# Altium schematic sheet SW SMALL.SchDoc
size C
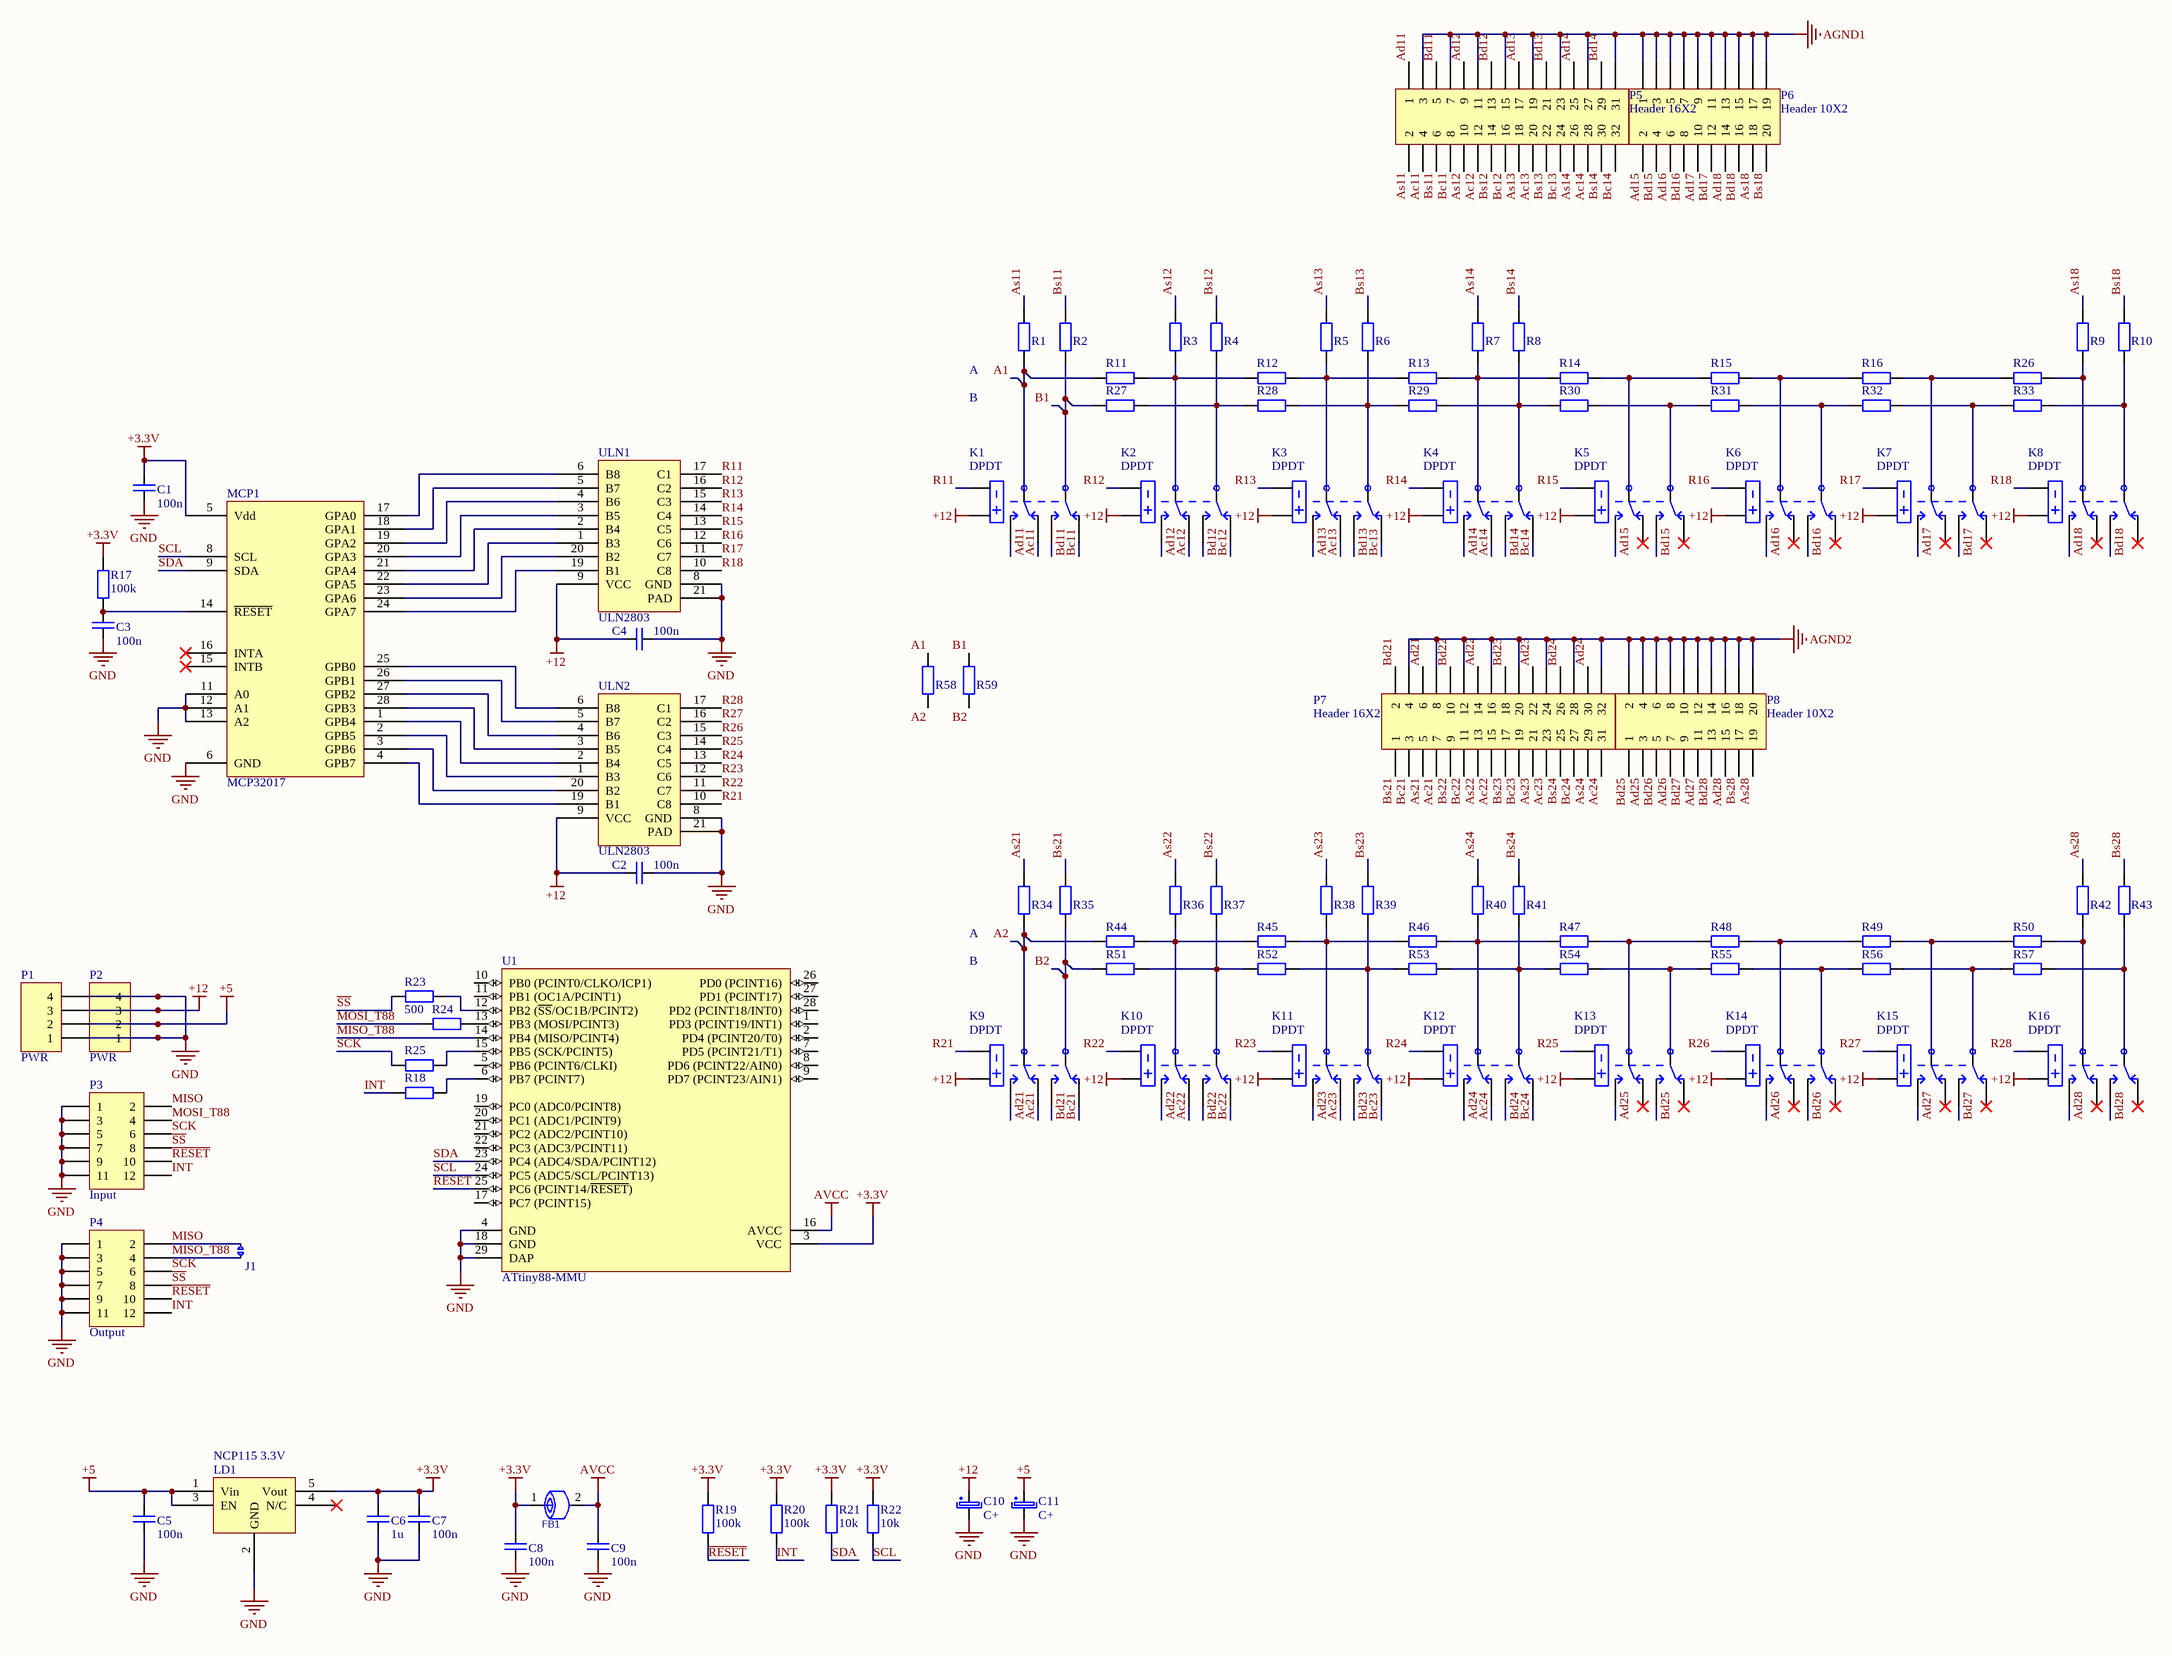
[diagram p0: SW SMALL.SchDoc]

## Parts
C1  100n  [R1005_0402i_L]
C2  100n  [R1005_0402i_L]
C3  100n  [R1005_0402i_L]
C4  100n  [R1005_0402i_L]
C5  100n  [R1005_0402i_L]
C6  1u  [C1608_0603I_L]
C7  100n  [R1005_0402i_L]
C8  100n  [R1005_0402i_L]
C9  100n  [R1005_0402i_L]
C10  C+  [C AlElko 5x11 R2]
C11  C+  [C AlElko 5x11 R2]
FB1  FERITTE BEAD  [R1608_0603I_L]  (value not drawn)
J1  Terminator  [solderJumper]  (value not drawn)
K1  DPDT  [AXICOM IM-G Relay]
K2  DPDT  [AXICOM IM-G Relay]
K3  DPDT  [AXICOM IM-G Relay]
K4  DPDT  [AXICOM IM-G Relay]
K5  DPDT  [AXICOM IM-G Relay]
K6  DPDT  [AXICOM IM-G Relay]
K7  DPDT  [AXICOM IM-G Relay]
K8  DPDT  [AXICOM IM-G Relay]
K9  DPDT  [AXICOM IM-G Relay]
K10  DPDT  [AXICOM IM-G Relay]
K11  DPDT  [AXICOM IM-G Relay]
K12  DPDT  [AXICOM IM-G Relay]
K13  DPDT  [AXICOM IM-G Relay]
K14  DPDT  [AXICOM IM-G Relay]
K15  DPDT  [AXICOM IM-G Relay]
K16  DPDT  [AXICOM IM-G Relay]
LD1  NCP115 3.3V  [TSOP95P280X110-6L]
MCP1  MCP32017  [MCP23017 QFN]
P1  PWR  [HDR1X4]
P2  PWR  [HDR1X4]
P3  Input  [1.27mm SMD conn]
P4  Output  [1.27mm SMD conn]
P5  Header 16X2  [HDR2X16]
P6  Header 10X2  [HDR2X10]
P7  Header 16X2  [HDR2X16]
P8  Header 10X2  [HDR2X10]
R1  R  [R1608_0603I_L]  (value not drawn)
R2  R  [R1608_0603I_L]  (value not drawn)
R3  R  [R1608_0603I_L]  (value not drawn)
R4  R  [R1608_0603I_L]  (value not drawn)
R5  R  [R1608_0603I_L]  (value not drawn)
R6  R  [R1608_0603I_L]  (value not drawn)
R7  R  [R1608_0603I_L]  (value not drawn)
R8  R  [R1608_0603I_L]  (value not drawn)
R9  R  [R1608_0603I_L]  (value not drawn)
R10  R  [R1608_0603I_L]  (value not drawn)
R11  R  [R1608_0603I_L]  (value not drawn)
R12  R  [R1608_0603I_L]  (value not drawn)
R13  R  [R1608_0603I_L]  (value not drawn)
R14  R  [R1608_0603I_L]  (value not drawn)
R15  R  [R1608_0603I_L]  (value not drawn)
R16  R  [R1608_0603I_L]  (value not drawn)
R17  100k  [R1005_0402i_L]
R18  500  [R1005_0402i_L]  (value not drawn)
R19  100k  [R1005_0402i_L]
R20  100k  [R1005_0402i_L]
R21  10k  [R1005_0402i_L]
R22  10k  [R1005_0402i_L]
R23  500  [R1005_0402i_L]
R24  500  [R1005_0402i_L]  (value not drawn)
R25  500  [R1005_0402i_L]  (value not drawn)
R26  R  [R1608_0603I_L]  (value not drawn)
R27  R  [R1608_0603I_L]  (value not drawn)
R28  R  [R1608_0603I_L]  (value not drawn)
R29  R  [R1608_0603I_L]  (value not drawn)
R30  R  [R1608_0603I_L]  (value not drawn)
R31  R  [R1608_0603I_L]  (value not drawn)
R32  R  [R1608_0603I_L]  (value not drawn)
R33  R  [R1608_0603I_L]  (value not drawn)
R34  R  [R1608_0603I_L]  (value not drawn)
R35  R  [R1608_0603I_L]  (value not drawn)
R36  R  [R1608_0603I_L]  (value not drawn)
R37  R  [R1608_0603I_L]  (value not drawn)
R38  R  [R1608_0603I_L]  (value not drawn)
R39  R  [R1608_0603I_L]  (value not drawn)
R40  R  [R1608_0603I_L]  (value not drawn)
R41  R  [R1608_0603I_L]  (value not drawn)
R42  R  [R1608_0603I_L]  (value not drawn)
R43  R  [R1608_0603I_L]  (value not drawn)
R44  R  [R1608_0603I_L]  (value not drawn)
R45  R  [R1608_0603I_L]  (value not drawn)
R46  R  [R1608_0603I_L]  (value not drawn)
R47  R  [R1608_0603I_L]  (value not drawn)
R48  R  [R1608_0603I_L]  (value not drawn)
R49  R  [R1608_0603I_L]  (value not drawn)
R50  R  [R1608_0603I_L]  (value not drawn)
R51  R  [R1608_0603I_L]  (value not drawn)
R52  R  [R1608_0603I_L]  (value not drawn)
R53  R  [R1608_0603I_L]  (value not drawn)
R54  R  [R1608_0603I_L]  (value not drawn)
R55  R  [R1608_0603I_L]  (value not drawn)
R56  R  [R1608_0603I_L]  (value not drawn)
R57  R  [R1608_0603I_L]  (value not drawn)
R58  R  [R1608_0603I_L]  (value not drawn)
R59  R  [R1608_0603I_L]  (value not drawn)
U1  ATtiny88-MMU  [28M1_N]
ULN1  ULN2803  [QFN127P600-8N]
ULN2  ULN2803  [QFN127P600-8N]

## Nets
+3.3V: C1.2 C6.1 C7.1 C8.1 FB1.1 LD1.5(Vout) MCP1.5(Vdd) R17.1 R19.1 R20.1 R21.1 R22.1 U1.3(VCC)
+5: C5.1 C11.1 LD1.1(Vin) LD1.3(EN) P1.2 P2.2
+12: C2.1 C4.1 C10.1 K1.1 K2.1 K3.1 K4.1 K5.1 K6.1 K7.1 K8.1 K9.1 K10.1 K11.1 K12.1 K13.1 K14.1 K15.1 K16.1 P1.3 P2.3 ULN1.9(VCC) ULN2.9(VCC)
AGND1: P5.3 P5.7 P5.11 P5.15 P5.19 P5.23 P5.27 P5.31 P6.1 P6.3 P6.5 P6.7 P6.9 P6.11 P6.13 P6.15 P6.17 P6.19
AGND2: P7.4 P7.8 P7.12 P7.16 P7.20 P7.24 P7.28 P7.32 P8.2 P8.4 P8.6 P8.8 P8.10 P8.12 P8.14 P8.16 P8.18 P8.20
AVCC: C9.1 FB1.2 U1.16(AVCC)
GND: C1.1 C2.2 C3.1 C4.2 C5.2 C6.2 C7.2 C8.2 C9.2 C10.2 C11.2 LD1.2(GND) MCP1.6(GND) MCP1.11(A0) MCP1.12(A1) MCP1.13(A2) P1.1 P1.4 P2.1 P2.4 P3.1 P3.3 P3.5 P3.7 P3.9 P3.11 P4.1 P4.3 P4.5 P4.7 P4.9 P4.11 U1.4(GND) U1.18(GND) U1.29(DAP) ULN1.8(GND) ULN1.21(PAD) ULN2.8(GND) ULN2.21(PAD)
A1: K1.3 R1.1 R11.1 R58.2
A2: K9.3 R34.1 R44.1 R58.1
Ac11: K1.2 P5.4
Ac12: K2.2 P5.12
Ac13: K3.2 P5.20
Ac14: K4.2 P5.28
Ac21: K9.2 P7.7
Ac22: K10.2 P7.15
Ac23: K11.2 P7.23
Ac24: K12.2 P7.31
Ad11: K1.4 P5.1
Ad12: K2.4 P5.9
Ad13: K3.4 P5.17
Ad14: K4.4 P5.25
Ad15: K5.4 P6.2
Ad16: K6.4 P6.6
Ad17: K7.4 P6.10
Ad18: K8.4 P6.14
Ad21: K9.4 P7.6
Ad22: K10.4 P7.14
Ad23: K11.4 P7.22
Ad24: K12.4 P7.30
Ad25: K13.4 P8.3
Ad26: K14.4 P8.7
Ad27: K15.4 P8.11
Ad28: K16.4 P8.15
As11: P5.2 R1.2
As12: P5.10 R3.2
As13: P5.18 R5.2
As14: P5.26 R7.2
As18: P6.18 R9.2
As21: P7.5 R34.2
As22: P7.13 R36.2
As23: P7.21 R38.2
As24: P7.29 R40.2
As28: P8.19 R42.2
B1: K1.6 R2.1 R27.1 R59.2
B2: K9.6 R35.1 R51.1 R59.1
Bc11: K1.7 P5.8
Bc12: K2.7 P5.16
Bc13: K3.7 P5.24
Bc14: K4.7 P5.32
Bc21: K9.7 P7.3
Bc22: K10.7 P7.11
Bc23: K11.7 P7.19
Bc24: K12.7 P7.27
Bd11: K1.5 P5.5
Bd12: K2.5 P5.13
Bd13: K3.5 P5.21
Bd14: K4.5 P5.29
Bd15: K5.5 P6.4
Bd16: K6.5 P6.8
Bd17: K7.5 P6.12
Bd18: K8.5 P6.16
Bd21: K9.5 P7.2
Bd22: K10.5 P7.10
Bd23: K11.5 P7.18
Bd24: K12.5 P7.26
Bd25: K13.5 P8.1
Bd26: K14.5 P8.5
Bd27: K15.5 P8.9
Bd28: K16.5 P8.13
Bs11: P5.6 R2.2
Bs12: P5.14 R4.2
Bs13: P5.22 R6.2
Bs14: P5.30 R8.2
Bs18: P6.20 R10.2
Bs21: P7.1 R35.2
Bs22: P7.9 R37.2
Bs23: P7.17 R39.2
Bs24: P7.25 R41.2
Bs28: P8.17 R43.2
INT: P3.12 P4.12 R18.1 R20.2
MISO: J1.2 P3.2 P4.2
MISO_T88: J1.1 P4.4 U1.14(PB4_(MISO/PCINT4))
MOSI_T88: P3.4 R24.1
R11: K1.8 ULN1.17(C1)
R12: K2.8 ULN1.16(C2)
R13: K3.8 ULN1.15(C3)
R14: K4.8 ULN1.14(C4)
R15: K5.8 ULN1.13(C5)
R16: K6.8 ULN1.12(C6)
R17: K7.8 ULN1.11(C7)
R18: K8.8 ULN1.10(C8)
R21: K9.8 ULN2.10(C8)
R22: K10.8 ULN2.11(C7)
R23: K11.8 ULN2.12(C6)
R24: K12.8 ULN2.13(C5)
R25: K13.8 ULN2.14(C4)
R26: K14.8 ULN2.15(C3)
R27: K15.8 ULN2.16(C2)
R28: K16.8 ULN2.17(C1)
~{RESET}: P3.10 P4.10 R19.2 U1.25(PC6_(PCINT14/~{RESET}))
~{SS}: P3.8 P4.8 R23.1
SCK: P3.6 P4.6 R25.1
SCL: MCP1.8(SCL) R22.2 U1.24(PC5_(ADC5/SCL/PCINT13))
SDA: MCP1.9(SDA) R21.2 U1.23(PC4_(ADC4/SDA/PCINT12))
NetC3_2: C3.2 MCP1.14(~{RESET}) R17.2
NetK2_3: K2.3 R3.1 R11.2 R12.1
NetK2_6: K2.6 R4.1 R27.2 R28.1
NetK3_3: K3.3 R5.1 R12.2 R13.1
NetK3_6: K3.6 R6.1 R28.2 R29.1
NetK4_3: K4.3 R7.1 R13.2 R14.1
NetK4_6: K4.6 R8.1 R29.2 R30.1
NetK5_3: K5.3 R14.2 R15.1
NetK5_6: K5.6 R30.2 R31.1
NetK6_3: K6.3 R15.2 R16.1
NetK6_6: K6.6 R31.2 R32.1
NetK7_3: K7.3 R16.2 R26.1
NetK7_6: K7.6 R32.2 R33.1
NetK8_3: K8.3 R9.1 R26.2
NetK8_6: K8.6 R10.1 R33.2
NetK10_3: K10.3 R36.1 R44.2 R45.1
NetK10_6: K10.6 R37.1 R51.2 R52.1
NetK11_3: K11.3 R38.1 R45.2 R46.1
NetK11_6: K11.6 R39.1 R52.2 R53.1
NetK12_3: K12.3 R40.1 R46.2 R47.1
NetK12_6: K12.6 R41.1 R53.2 R54.1
NetK13_3: K13.3 R47.2 R48.1
NetK13_6: K13.6 R54.2 R55.1
NetK14_3: K14.3 R48.2 R49.1
NetK14_6: K14.6 R55.2 R56.1
NetK15_3: K15.3 R49.2 R50.1
NetK15_6: K15.6 R56.2 R57.1
NetK16_3: K16.3 R42.1 R50.2
NetK16_6: K16.6 R43.1 R57.2
NetMCP1_1: MCP1.1(GPB4) ULN2.2(B4)
NetMCP1_2: MCP1.2(GPB5) ULN2.1(B3)
NetMCP1_3: MCP1.3(GPB6) ULN2.20(B2)
NetMCP1_4: MCP1.4(GPB7) ULN2.19(B1)
NetMCP1_17: MCP1.17(GPA0) ULN1.6(B8)
NetMCP1_18: MCP1.18(GPA1) ULN1.5(B7)
NetMCP1_19: MCP1.19(GPA2) ULN1.4(B6)
NetMCP1_20: MCP1.20(GPA3) ULN1.3(B5)
NetMCP1_21: MCP1.21(GPA4) ULN1.2(B4)
NetMCP1_22: MCP1.22(GPA5) ULN1.1(B3)
NetMCP1_23: MCP1.23(GPA6) ULN1.20(B2)
NetMCP1_24: MCP1.24(GPA7) ULN1.19(B1)
NetMCP1_25: MCP1.25(GPB0) ULN2.6(B8)
NetMCP1_26: MCP1.26(GPB1) ULN2.5(B7)
NetMCP1_27: MCP1.27(GPB2) ULN2.4(B6)
NetMCP1_28: MCP1.28(GPB3) ULN2.3(B5)
NetR18_2: R18.2 U1.6(PB7_(PCINT7))
NetR23_2: R23.2 U1.12(PB2_(~{SS}/OC1B/PCINT2))
NetR24_2: R24.2 U1.13(PB3_(MOSI/PCINT3))
NetR25_2: R25.2 U1.15(PB5_(SCK/PCINT5))

Not connected (* = marked no-connect by the designer): K5 2* 7*; K6 2* 7*; K7 2* 7*; K8 2* 7*; K13 2* 7*; K14 2* 7*; K15 2* 7*; K16 2* 7*; LD1 4(N/C)*; MCP1 15(INTB)* 16(INTA)*; U1 1(PD3_(PCINT19/INT1)) 2(PD4_(PCINT20/T0)) 5(PB6_(PCINT6/CLKI)) 7(PD5_(PCINT21/T1)) 8(PD6_(PCINT22/AIN0)) 9(PD7_(PCINT23/AIN1)) 10(PB0_(PCINT0/CLKO/ICP1)) 11(PB1_(OC1A/PCINT1)) 17(PC7_(PCINT15)) 19(PC0_(ADC0/PCINT8)) 20(PC1_(ADC1/PCINT9)) 21(PC2_(ADC2/PCINT10)) 22(PC3_(ADC3/PCINT11)) 26(PD0_(PCINT16)) 27(PD1_(PCINT17)) 28(PD2_(PCINT18/INT0))

## Notes on the sheet
- (near R1) A
- B
- (near R34) A
- Title
- Size:
- Date:
- File:
- C
- Number:
- Time:
- Revision:
- Sheet
- of

## Library data of the parts
C1-C9 = C: Capacitor
C10 C11 = C+: Capacitor Polarized
J1 = JMP_mini
K1-K16 = IM-GR Relay DPDT: TE CONNECTIVITY  IM-GR  RELAY, DPDT, NO; Farnell ID: 1175070; URL: http://si.farnell.com/te-connectivity-axicom/im06gr/relay-gull-wing-dpco-12vdc-2a/dp/1175070
P1 P2 = Header 4: Header, 4-Pin; LatestRevisionDate: 17-Jul-2002; LatestRevisionNote: Re-released for DXP Platform.; Publisher: Altium Limited
P3 P4 = Header 6X2: Header, 6-Pin, Dual row; LatestRevisionDate: 17-Jul-2002; LatestRevisionNote: Re-released for DXP Platform.; Publisher: Altium Limited
P5 P7 = Header 16X2: Header, 16-Pin, Dual row; LatestRevisionDate: 17-Jul-2002; LatestRevisionNote: Re-released for DXP Platform.; Publisher: Altium Limited
P6 P8 = Header 10X2: Header, 10-Pin, Dual row; LatestRevisionDate: 17-Jul-2002; LatestRevisionNote: Re-released for DXP Platform.; Publisher: Altium Limited
R17-R25 = R
U1 = ATtiny88-MMU: 8-bit AVR Microcontroller, 1.8-5.5V, 8KB Flash, 64 Bytes EEPROM, 512 Bytes SRAM, 28-pin MLF, Industrial Grade (-40°C to 85°C), Pb-Free; Published: 1-Apr-2010; DatasheetVersion: revC, Mar-2009; PackageVersion: revB, Nov-2008; PackageReference: 28M1; Publisher: Altium Limited; PackageDescription: 28-pad, 4x4x1.0mm Body, Pitch 0.45mm, 2.4x2.4mm Exposed Pad, Plastic Very Thin QFN Package (VQFN); Supplier 1: Digi-Key; Supplier Part Number 1: ATTINY88-MMU-ND; Supplier 2: Mouser; Supplier Part Number 2: 556-ATTINY88-MMU; ComponentLink1Description: Manufacturer Link; ComponentLink1URL: http://www.atmel.com/products/avr/default.asp?; ComponentLink2Description: ATtiny48/88 Datasheet; ComponentLink2URL: http://www.atmel.com/dyn/resources/prod_documents/doc8008.pdf; ComponentLink3Description: ATtiny48/88 Summary; ComponentLink3URL: http://www.atmel.com/dyn/resources/prod_documents/8008S.pdf; ComponentLink4Description: Atmel.com Home; ComponentLink4URL: http://www.atmel.com